# Altium schematic sheet schematic.SchDoc
size A; SheetNumber: 1; SheetTotal: 1
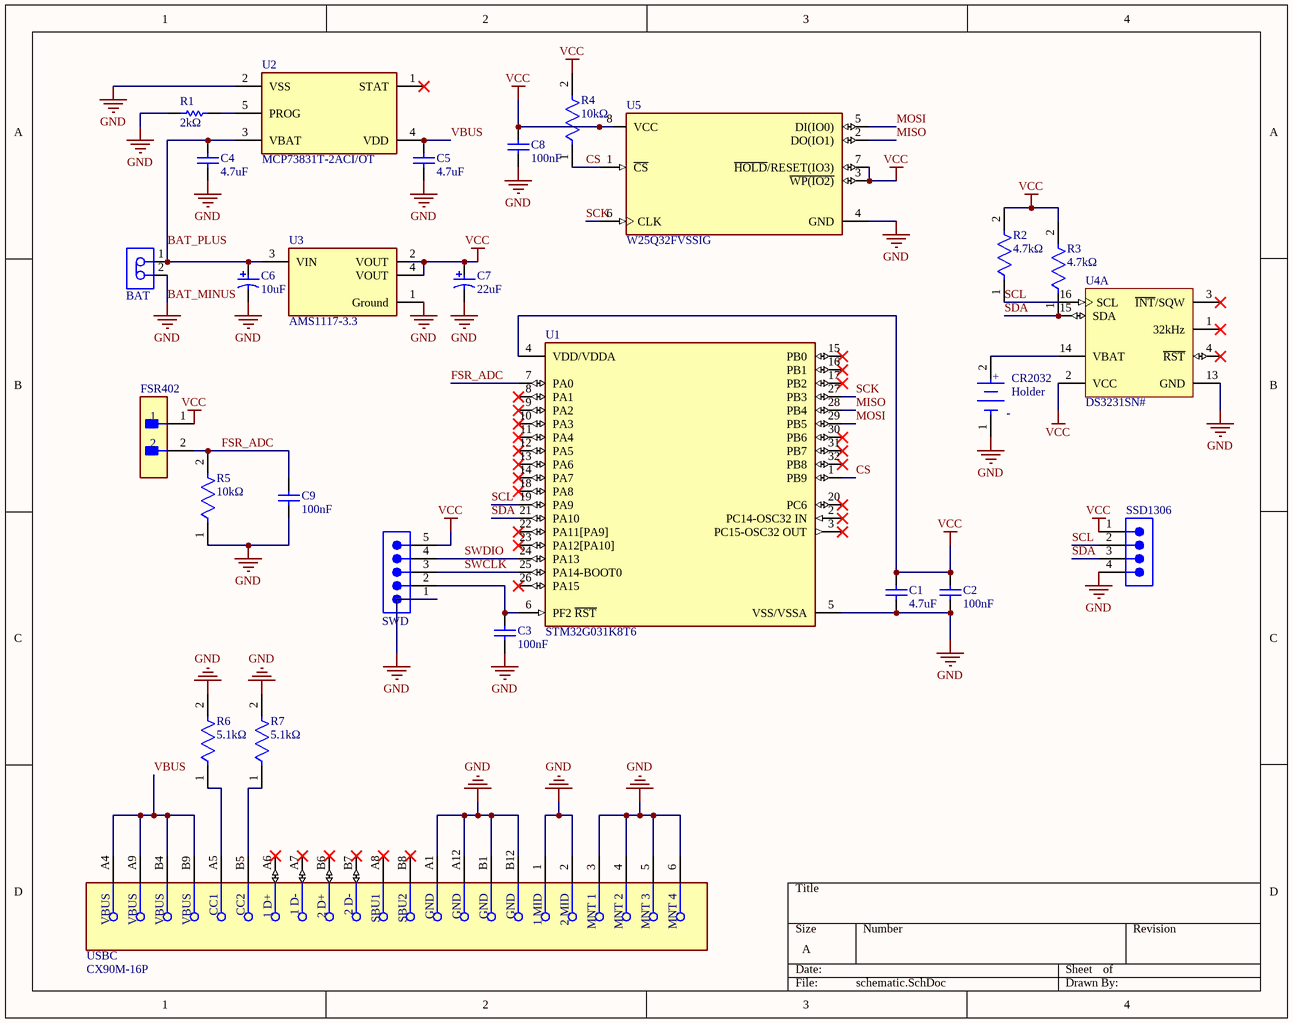
[diagram p0: schematic.SchDoc]

## Parts
BAT  B2B-PH-K-S(LF)(SN)  [JST-B2B-PH-K-S_V]  (value not drawn)
C1  4.7uF  [CAPC1608X90X35ML15T15]
C2  100nF  [CAPC1608X87X35LL15T15]
C3  100nF  [CAPC1608X87X35LL15T15]
C4  4.7uF  [CAPC1608X90X35ML15T15]
C5  4.7uF  [CAPC1608X90X35ML15T15]
C6  10uF  [KEMT-T322-2_V]
C7  22uF  [KEMT-T491-B_L]
C8  100nF  [CAPC1608X87X35LL15T15]
C9  100nF  [CAPC1608X87X35LL15T15]
CR2032  Holder  [FP-1775485-1-MFG]
FSR402  (no value)  [FP-B02B-WPJSS-1_LF_SN-MFG]
R1  2kΩ  [RESC1608X55X25LL10T15]
R2  4.7kΩ  [FP-RMCF0603-IPC_B]
R3  4.7kΩ  [FP-RMCF0603-IPC_B]
R4  10kΩ  [FP-AC0603-IPC_A]
R5  10kΩ  [FP-AC0603-IPC_A]
R6  5.1kΩ  [FP-MCR03-IPC_B]
R7  5.1kΩ  [FP-MCR03-IPC_B]
SSD1306  691317710004  [691317710004]  (value not drawn)
SWD  691305330005  [691305330005]  (value not drawn)
U1  STM32G031K8T6  [FP-LQFP32-5V-MFG]
U2  MCP73831T-2ACI/OT  [FP-C04-091-OT-IPC_B]
U3  AMS1117-3.3  [FP-AMS1117-IPC_C]
U4  DS3231SN#  [W16#H2_L]  (part A of 2)
U5  W25Q32FVSSIG  [FP-SS-MFG]
USBC  CX90M-16P  [FP-CX90M-16P-MFG]

## Nets
BAT_MINUS: BAT.2 C1.1 C2.1 C3.2 C4.1 C5.1 C6.2 C7.2 C8.1 C9.1 CR2032.1(C) R1.1 R5.1 R6.2 R7.2 SSD1306.4 SWD.1 U1.5(VSS/VSSA) U2.2(VSS) U3.1(Ground) U4.13(GND) U5.4(GND) USBC.1(1_MID) USBC.2(2_MID) USBC.3(MNT_1) USBC.4(MNT_2) USBC.5(MNT_3) USBC.6(MNT_4) USBC.A1(GND) USBC.A12(GND) USBC.B1(GND) USBC.B12(GND)  [also labelled GND]
VCC: C1.2 C2.2 C7.1 C8.2 FSR402.1 R2.2 R3.2 R4.2 SSD1306.1 SWD.5 U1.4(VDD/VDDA) U3.2(VOUT) U3.4(VOUT) U4.2(VCC) U5.3(~{WP(IO2)}) U5.7(~{HOLD}/RESET(IO3)) U5.8(VCC)
BAT_PLUS: BAT.1 C4.2 C6.1 U2.3(VBAT) U3.3(VIN)
CS: R4.1 U1.1(PB9) U5.1(~{CS})
FSR_ADC: C9.2 FSR402.2 R5.2 U1.7(PA0)
MISO: U1.28(PB4) U5.2(DO(IO1))
MOSI: U1.29(PB5) U5.5(DI(IO0))
SCK: U1.27(PB3) U5.6(CLK)
SCL: R2.1 SSD1306.2 U1.19(PA9) U4.16(SCL)
SDA: R3.1 SSD1306.3 U1.21(PA10) U4.15(SDA)
SWCLK: SWD.3 U1.25(PA14-BOOT0)
SWDIO: SWD.4 U1.24(PA13)
VBUS: C5.2 U2.4(VDD) USBC.A4(VBUS) USBC.A9(VBUS) USBC.B4(VBUS) USBC.B9(VBUS)
NetC3_1: C3.1 SWD.2 U1.6(PF2_~{RST})
NetCR2032_2: CR2032.2(A) U4.14(VBAT)
NetR1_2: R1.2 U2.5(PROG)
NetR6_1: R6.1 USBC.A5(CC1)
NetR7_1: R7.1 USBC.B5(CC2)

Not connected (* = marked no-connect by the designer): U1 2(PC14-OSC32_IN)* 3(PC15-OSC32_OUT)* 8(PA1)* 9(PA2)* 10(PA3)* 11(PA4)* 12(PA5)* 13(PA6)* 14(PA7)* 15(PB0)* 16(PB1)* 17(PB2)* 18(PA8)* 20(PC6)* 22(PA11[PA9])* 23(PA12[PA10])* 26(PA15)* 30(PB6)* 31(PB7)* 32(PB8)*; U2 1(STAT)*; U4 1(32kHz)* 3(~{INT}/SQW)* 4(~{RST})*; USBC A6(1_D+)* A7(1_D-)* A8(SBU1)* B6(2_D+)* B7(2_D-)* B8(SBU2)*

## Notes on the sheet
- (in symbol CMP-03355-000025-1) +; -

## Library data of the parts
BAT = CMP-2000-05162-1: Male Header, Pitch 2 mm, 1 x 2 Position, Height 6 mm, Tail Length 3.4 mm, -25 to 85 degC, RoHS, Bulk; Manufacturer: JST; Pitch: 2mm; Style/Orientation: StraightHeader/Plug; No of Positions: 2; Datasheet Version: Nov-08; Datasheet URL: http://datasheet.octopart.com/B2B-PH-K-S%28LF%29%28SN%29-JST-datasheet-8324864.pdf; Manufacturer URL: http://www.jst.com/home2.html; Type: ShroudedHeader; Termination: Crimp
C1 C4 C5 = CMP-2006-02288-1: C0603C475K9PAC7411; Manufacturer: Kemet; Part Number: C0603C475K9PAC7411
C2 C3 C8 C9 = CMP-2006-03843-1: C0603T104K3RACTU; Manufacturer: Kemet; Part Number: C0603T104K3RACTU
C6 = CMP-2000-05177-1: T322C106K025AT; Manufacturer: Kemet; Material, Element: Tantalum; Brand/Series: T322Series; Capacitance: 10μF; Voltage, Rating: 25VDC; Tolerance: -10,+10%; Configuration: Axial; Mounting Type: PCB; Datasheet Version: Oct-05; Datasheet URL: http://download.siliconexpert.com/pdfs/2005/12/01/pemco_a/4/kmt/capacitors/f3100etamoldaxrad.pdf; Termination: Through-hole; Manufacturer URL: http://www.kemet.com/
C7 = CMP-2000-07193-1: T491B226K010AT; Manufacturer: Kemet; Lead Spacing (nom): NotRequiredmm; Polarity: Polar; Insulation: NotRequired; Voltage: 10VDC; DCL: 2.2uA; ESR: 2.4ohm; Rad Hardened: No; Capacitance: 22000000pF; Product Length (mm): 3.5mm; Case Style: Molded; Tolerance (+ or -): 10%; Product Depth (mm): 2.8mm; DF: 6%; Product Height (mm): 1.9mm; Seated Plane Height: NotRequiredmm; Failure Rate: NotRequired; Datasheet URL: http://capacitoredge.kemet.com/capedge2/DataSheet/Datasheet-T491B226K010AT.pdf?pn=T491B226K010AT; Mounting Technology: SurfaceMount; Datasheet Version: 10/2016; Construction: SMTChip; Package Reference: T491-B; Product Diameter (mm): NotRequiredmm; Operating Temp Range: -55Cto125C; Manufacturer URL: http://www.kemet.com/; Wire Form: NotRequired; Case Code: B; Packaging: TapeandReel; Length W/Weld: NotRequiredmm; Package Description: 2-Pin Surface Mount Device, Body 3.5 x 2.8 mm; Length W/Weld (max): NotRequiredmm; Seal: NotRequired; Mounting Style: SurfaceMount; Package / Case: 3528-21
CR2032 = CMP-03355-000025-1: BATT HLDR COIN 20MM 1 CEL PC PIN; Material: Nylon; Number of Contacts: 2; Color: Black; Number of Ports: 1; Package Quantity: 80; Packaging: Tray; Orientation: Straight; Radiation Hardening: No; ELV: Compliant; Contact Material: Stainless Steel; Number of Terminals/Pins: 2; RoHS Compliant: Yes; Housing Color: Black; Mount: Through Hole; Number of Positions: 2; Housing Material: Nylon; Termination: Solder
FSR402 = CMP-17439-000657-1: CONN HEADER VERT 2POS 5MM; Voltage Rating: 300V; Mated Stacking Heights: 25.3mm; Ratings: Waterproof; Gender: Male; Current Rating: 7A; Number of Contacts: 2; Wire/Cable Gauge: 18AWG; Fastening Type: Latch; Housing Material: PBT; Reach SVHC Compliant: Yes; Color: Natural; Max Operating Temperature: 85°C; Insulation Material: PBT; Contact Material: Copper Alloy; Contact Type: Male Pin; Lead Free: Lead Free; Pitch: 5mm; Contact Shape: Square; Connector Type: Header; Orientation: Straight; Voltage Rating (AC): 300V; Series: WPJ; Flammability Rating: UL94 V-0; Termination: Solder; Contact Plating: Tin; Number of Rows: 1; Insulation Color: Natural; Packaging: Bulk; Number of Positions: 2; Lead Pitch: 5mm; Min Operating Temperature: -25°C; Mount: Through Hole; Contact Finish - Mating: TIN
R1 = CMP-2000-04183-1: RC0603FR-102KL; Manufacturer: Yageo; Part Number: RC0603FR-102KL
R2 R3 = CMP-26527-004068-1: RMCF0603FG4K70; Resistance: 4.7kR; Tolerance: 1%; Temperature Coefficient: 100ppm/°C; Max Power Dissipation: 100mW; Length: 0.061inch; Series: RMCF; Resistor Type: Thick Film; Packaging: Tape and Reel; Features: Automotive AEC-Q200; Max Operating Temperature: 155°C; Number of Terminations: 2; RoHS Compliant: Yes; Case/Package: 0603; Width: 0.031inch; Height: 0.022inch; Min Operating Temperature: -55°C; Mount: Surface Mount
R4 R5 = CMP-03412-040683-1: RES 10kΩ 5.00% 0.2W 0603
R6 R7 = CMP-08839-027005-1: MCR03EZPJ512; Resistance: 5.1kR; Voltage Rating (DC): 50V; Max Power Dissipation: 100mW; Temperature Coefficient: 200ppm/°C; Tolerance: 5%; Width: 0.031inch; Case Code (Imperial): 0603; Features: Automotive AEC-Q200; Package Quantity: 5000; Number of Terminations: 2; Min Operating Temperature: -55°C; Resistor Type: Thick Film; Max Operating Temperature: 155°C; Contact Plating: Tin; Working Voltage: 50V; Technology: THICK FILM; Height: 0.022inch; Power Rating: 100mW; Lead Free: Lead Free; Series: MCR; Length: 0.063inch; Case Code (Metric): 1608; Case/Package: 0603; Mount: Surface Mount; RoHS Compliant: Yes; Packaging: Tape and Reel
SSD1306 = CMP-1502-02058-3: Terminal Block, 5.00MM Pitch, Close Horizontal Pcb Header, Flanges, 4 Pins
SWD = CMP-1502-01818-3: Terminal Block, Header, 5Pos, Th Rohs Compliant: Yes; Gender: Male; Number of Pins: 5; Lead Pitch: 3.81mm; Packaging: Box
U1 = CMP-12105-000118-1: IC MCU 32BIT 64KB FLASH 32LQFP
U2 = CMP-0133-00143-2: IC CONTROLLR LI-ION 4.2V SOT23-5; Max Power Dissipation: 1.54W; Output Current: 500mA; Max Output Voltage: 4.5V; Number of Outputs: 1; Min Output Voltage: 4.168V; Min Supply Voltage: 3.75V; Max Input Voltage: 6V; Voltage Rating: 4.534V; Drain to Source Resistance: 350mR; Max Operating Temperature: 85°C; Length: 0.122inch; Number of Pins: 5; REACH SVHC: No SVHC; Radiation Hardening: No; Min Operating Temperature: -40°C; Weight: 0.00709oz; Contact Plating: Tin; Termination: SMD/SMT; Case/Package: SOT-23; Mount: Surface Mount; Width: 0.071inch; Packaging: Tape and Reel; Number of Cells: 1; Max Charge Current: 500mA; Height: 0.051inch; Number of Channels: 1; Output Voltage: 4.2V; Max Supply Voltage: 6V; Lead Free: Lead Free
U3 = CMP-209535-000001-1: LDO Voltage Regulators 1A, 3.3V; Manufacturer: Advanced Monolithic Systems; Dropout Voltage: 1.1V; Output Type: Fixed; Nominal Supply Current: 5mA; Max Power Dissipation: 1.2W; Max Supply Voltage: 15V; Number Of Outputs: 1; Standoff Height: 0.64mm; Max Junction Temp: +125°C; Height: 1.8mm; Package: AMS1117; Device Class L2: Power Management ICs; ComponentLink2Description: Datasheet; ComponentLink2URL: http://www.advanced-monolithic.com/pdf/ds1117.pdf; Category: IC; RoHS: TRUE; Automotive: No; Device Class L1: Integrated Circuits (ICs); Output Current: 1A; Device Class L3: Voltage Regulators - Linear; Temperature: -40°C to +125°C; Output Voltage: 3.3V; Manufacturer Part Number: AMS1117-3.3; Temperature Range Low: -40°C; Octopart: https://octopart.com/ams1117-3.3-advanced+monolithic+systems-25899300; Lead Free: Yes; Ipc Land Pattern Name: SOT229P700X180-4; Temperature Range High: +125°C
U4 = CMP-0254-00293-2: Extremely Accurate I2C-Integrated Real-Time Clock/TCXO/Crystal, 16-Pin SO, -40 to 85 degC, RoHS Qualified; Code_IPC: SOIC127P1030-16; ComponentLink2URL: http://datasheets.maxim-ic.com/en/ds/DS3231.pdf; Code_JEDEC: MS-013-AA; ComponentLink1URL: http://www.maxim-ic.com; ComponentLink2Description: Datasheet; ComponentLink3Description: Package Specification; DatasheetVersion: Rev 8, Jul-2010; PackageVersion: revD, 2010; ComponentLink1Description: Manufacturer URL; PackageDescription: 16-Pin Small-Outline IC, Wide (0.3in), 1.27 mm Pitch, SOIC (W), RoHS Qualified; ComponentLink3URL: http://pdfserv.maxim-ic.com/package_dwgs/21-0042.PDF; PackageReference: W16#H2
U5 = CMP-2000-05006-2: IC FLASH 32M SPI 104MHZ 8SOIC; Manufacturer: Winbond; Obsolete Part: true; Access Time: 7ns; Nominal Supply Current: 8-20mA; Memory Size: 32Mbits; Max Supply Voltage: 3.6V; Min Supply Voltage: 2.7V; Standoff Height: 0.05mm; Interface: SPI,Other; Package: SS; Memory Type: FLASH; Ipc Land Pattern Name: SOIC127P790X195-8; Temperature Range High: +85°C; Temperature: -40°C to +85°C; Octopart: https://octopart.com/w25q32fvssig-winbond-23896462; Manufacturer Part Number: W25Q32FVSSIG; Ambient Temperature Range Low: -40°C; Lead Free: Yes; Height: 2.16mm; Automotive: No; Device Class L2: Memory; Digikey Description: IC FLASH 32M SPI 104MHZ 8SOIC; RoHS: TRUE; Frequency: 104MHz; Ambient Temperature Range High: +85°C; ComponentLink2Description: Datasheet; Category: IC; Device Class L1: Integrated Circuits (ICs); Device Class L3: Flash; Temperature Range Low: -40°C; Footprint Url: http://www.winbond.com/resource-files/an0000009%20spiflash%20pcb%20layout%20guideline%20v2.0%2009252017.pdf?__locale=en; ComponentLink2URL: https://www.winbond.com/resource-files/w25q32fv%20revj%2006032016.pdf
USBC = CMP-11601-000005-1: CONN RCPT USB2.0 TYPEC 16POS SMD; Connector Type: USB; Current Rating: 1.25A; Mating Cycles: 10000; Number of Contacts: 16; Gender: Receptacle; Shielding: Shielded; Number of Ports: 1; Insulation Color: Black; Termination: Solder; Min Operating Temperature: -30°C; Flammability Rating: UL94 V-0; Max Operating Temperature: 85°C; Packaging: Cut Tape; Contact Plating: Gold; Mount: Surface Mount